# EasyEDA Pro project ProPrj_智能视觉集成板-V1.1.epro, board PCB4
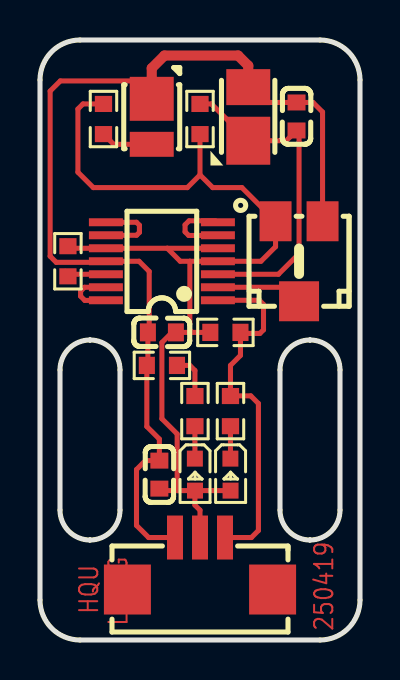
[diagram p15: board, top side]
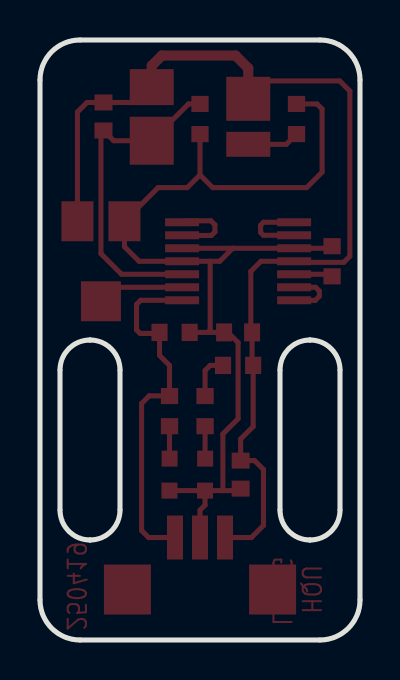
[diagram p16: board, bottom side, seen from below]

Outline 16 x 30 mm; copper layers: Top Layer, Bottom Layer. Coordinates in mm from the lower left corner of the outline.
Outline path: 0,28 0,2 arc(0.59,0.59) 2,0 14,0 arc(15.41,0.59) 16,2 16,28 arc(15.41,29.41) 14,30 2,30 arc(0.59,29.41) 0,28 ; 1,13.5 1,6.5 arc(1.44,5.44) 2.5,5 arc(3.56,5.44) 4,6.5 4,13.5 arc(3.56,14.56) 2.5,15 arc(1.44,14.56) 1,13.5 ; 12,13.5 12,6.5 arc(12.44,5.44) 13.5,5 arc(14.56,5.44) 15,6.5 15,13.5 arc(14.56,14.56) 13.5,15 arc(12.44,14.56) 12,13.5
Stack: Top Layer 0.035mm / Dielectric1 1.51mm FR4 er 4.5 / Bottom Layer 0.035mm

## Design rules (mm)
template: JLCPCB Capability(Two Layers Board)
spacing copperThickness1oz (default): track to track 0.102, other pairs 0.152 to 0.3
spacing copperThickness2oz: track to track 0.203, other pairs 0.152 to 0.3
track width copperThickness1oz (default): min 0.127, default 0.254, max 2.54
track width copperThickness2oz: min 0.203, default 0.254, max 2.54
differential pair differentialPair (default): width min 0.127, default 0.254, max 2.54; gap min 0.152, default 0.152
via viaSize (default): diameter min 0.5, default 0.61, max 10; hole min 0.3, default 0.305, max 6.3

## Placement (name value [footprint] x y rotation side)
C2  100nF  [C0603]  12.83 26.18 270 top
C3  100nF  [C0603]  5.97 8.27 270 top
C4  100nF  [C0603]  6.09 15.38 0 top
CN11  HC-1.25-3PWT  [CONN-SMD_HC-1.25-3PWT]  8 3.82 0 top
LED1  XL-2835UWC-02  [LED-SMD_L3.5-W2.8-RD_1.25T-2PWT]  5.59 25.92 270 top
LED2  NCD0603R1  [LED0603-RD_RED]  9.52 8.27 270 top
LED3  NCD0603R1  [LED0603-RD_RED]  7.75 8.27 270 top
R1  10kΩ  [R0603]  8 26.05 90 top
R2  470Ω  [R0603]  3.17 26.05 270 top
R3  10kΩ  [RES-ADJ-TH_3P-L5.0-W4.5-P2.35-BR]  12.95 18.94 180 top
R4  10kΩ  [R0603]  9.27 15.38 180 top
R5  1kΩ  [R0603]  9.52 11.44 270 top
R6  1kΩ  [R0603]  7.75 11.44 270 top
R7  0Ω  [R0603]  1.4 18.94 90 top
R8  0Ω  [R0603]  6.09 13.73 0 top
U1  SLPT3528AC-A1  [OPTO-SMD_L3.5-W2.8-FD]  10.41 26.3 90 top
U2  OPA4377  [TSSOP-14_L5.0-W4.4-P0.65-LS6.4-BL]  6.09 18.94 90 top

## Footprints (pads in the part's own frame, mm; a bottom-side part is the same pattern mirrored in y, then rotated)
C0603
  rect 0.8x0.9 smd: 1(-0.7,0) 2(0.7,0)
CONN-SMD_HC-1.25-3PWT
  rect 0.8x2.2 smd: 1(-1.25,1.3) 2(0,1.3) 3(1.25,1.3)
  rect 2.35x2.5 smd: 4(-3.63,-1.3) 5(3.63,-1.3)
LED0603-RD_RED
  rect 0.8x0.8 smd: 1(-0.799,-0.004) 2(0.799,0.004)
LED-SMD_L3.5-W2.8-RD_1.25T-2PWT
  rect 2.2x2.2 smd: 1(-1.137,0)
  rect 1.25x2.2 smd: 2(1.137,0)
OPTO-SMD_L3.5-W2.8-FD
  rect 2.4x2.2 smd: 1(-1.34,0)
  rect 1.8x2.2 smd: 2(1.34,0)
R0603
  rect 0.806x0.864 smd: 1(-0.753,0) 2(0.753,0)
RES-ADJ-TH_3P-L5.0-W4.5-P2.35-BR
  rect 1.6x2 smd: 1(1.175,-2) 3(-1.175,-2)
  rect 2x2 smd: 2(0,2)
TSSOP-14_L5.0-W4.4-P0.65-LS6.4-BL
  rect 0.4x1.7 smd: 1(-1.95,-2.8) 2(-1.3,-2.8) 3(-0.65,-2.8) 4(0,-2.8) 5(0.65,-2.8) 6(1.3,-2.8) 7(1.95,-2.8) 8(1.95,2.8) 9(1.3,2.8) 10(0.65,2.8) 11(0,2.8) 12(-0.65,2.8) 13(-1.3,2.8) 14(-1.95,2.8)

## Nets
As in the schematic.

Pads without a net: CN11 4 5

## Routing (per net, layer and track width the routed paths; a pad name or vN(x,y) marks a point on that pad's centre or on a via; arc(x,y) is an arc through that point)
GND: length 55.2
  Top Layer w0.254: CN11.1 5.43,5.12 4.82,5.73 4.82,8.52 5.27,8.97 5.97,8.97 5.97,10.05 5.34,10.67 R8.1 5.4,13.78 C4.1 5.46,15.45 5.46,18.43 4.95,18.94 U2.11 3.24,18.88 0.81,18.88 0.51,19.19 0.51,27.45 1.01,27.95 4.69,27.95 LED1.1 ; R8.2 7.49,13.73 7.75,13.48 R6.1 ; U1.2 11.18,26.88 C2.1 13.65,26.88 14.13,26.4 R3.3
  Top Layer w0.508: LED1.1 5.59,28.59 6.22,29.22 9.91,29.22 10.41,28.72 U1.2
VCC: length 55.1
  Top Layer w0.254: R4.2 7.61,15.38 ; 7.61,15.38 7.49,15.5 7.49,18.94 ; 7.61,15.38 C4.2 6.6,15.38 6.09,14.87 6.09,11.06 6.86,10.3 6.86,7.51 6.9,7.47 ; 7.49,18.94 U2.4 11.05,18.94 11.78,19.67 R3.1 10.09,22.62 8.63,22.62 8,23.25 ; 7.49,18.94 7.01,18.94 6.36,19.59 ; 6.9,7.47 6.07,7.47 C3.2 ; 6.9,7.47 7.75,7.47 ; CN11.2 8,6.49 7.75,6.75 7.75,7.47 LED3.2 LED2.2 ; 1.27,19.94 1.63,19.59 U2.10 6.36,19.59 ; 8,23.25 7.37,22.62 2.67,22.62 1.9,23.39 1.9,26.55 2.15,26.8 R2.1 ; 8,23.25 R1.1 ; 1.27,18.44 1.42,18.29 3.29,18.29 ; 6.36,19.59 U2.5
ADC: length 16.5
  Top Layer w0.254: 8.9,18.29 11.92,18.29 12.95,19.32 12.95,25.35 C2.2 12.31,24.96 U1.1 8.57,26.8 R1.2
OUT: length 18
  Top Layer w0.254: U2.1 10.97,16.99 11.18,16.78 11.18,15.51 11,15.33 10.08,15.33 R4.1 10.02,14.23 9.52,13.73 R5.1 9.53,12.21 10.54,12.21 10.92,11.83 10.92,5.47 10.57,5.12 CN11.3
$1N568: length 2.6
  Top Layer w0.254: LED1.2 3.69,24.78 R2.2
$1N1173: length 4.3
  Top Layer w0.254: R3.2 12.25,17.64 U2.2
$1N1514: length 1.6
  Top Layer w0.254: LED2.1 9.52,9.07 R5.2
$1N1929: length 1.6
  Top Layer w0.254: LED3.1 7.75,9.07 R6.2
$1N2309: length 3.7
  Top Layer w0.254: 8.78,20.96 7.45,20.96 7.25,20.76 7.25,20.41 7.43,20.23 8.89,20.23 U2.6
$1N2318: length 3
  Top Layer w0.254: U2.13 2.22,17.64 2.03,17.44 2.03,17.19 2.24,16.98 3.29,16.98 U2.14
$1N2328: length 3.8
  Top Layer w0.254: U2.9 4.83,20.24 4.97,20.38 4.97,20.74 4.82,20.89 U2.8

## Text on the board
Top Layer: HQU / LDTYG | 250419
